# EAGLE design AVR-USB-Downloader (EAGLE 6.3)
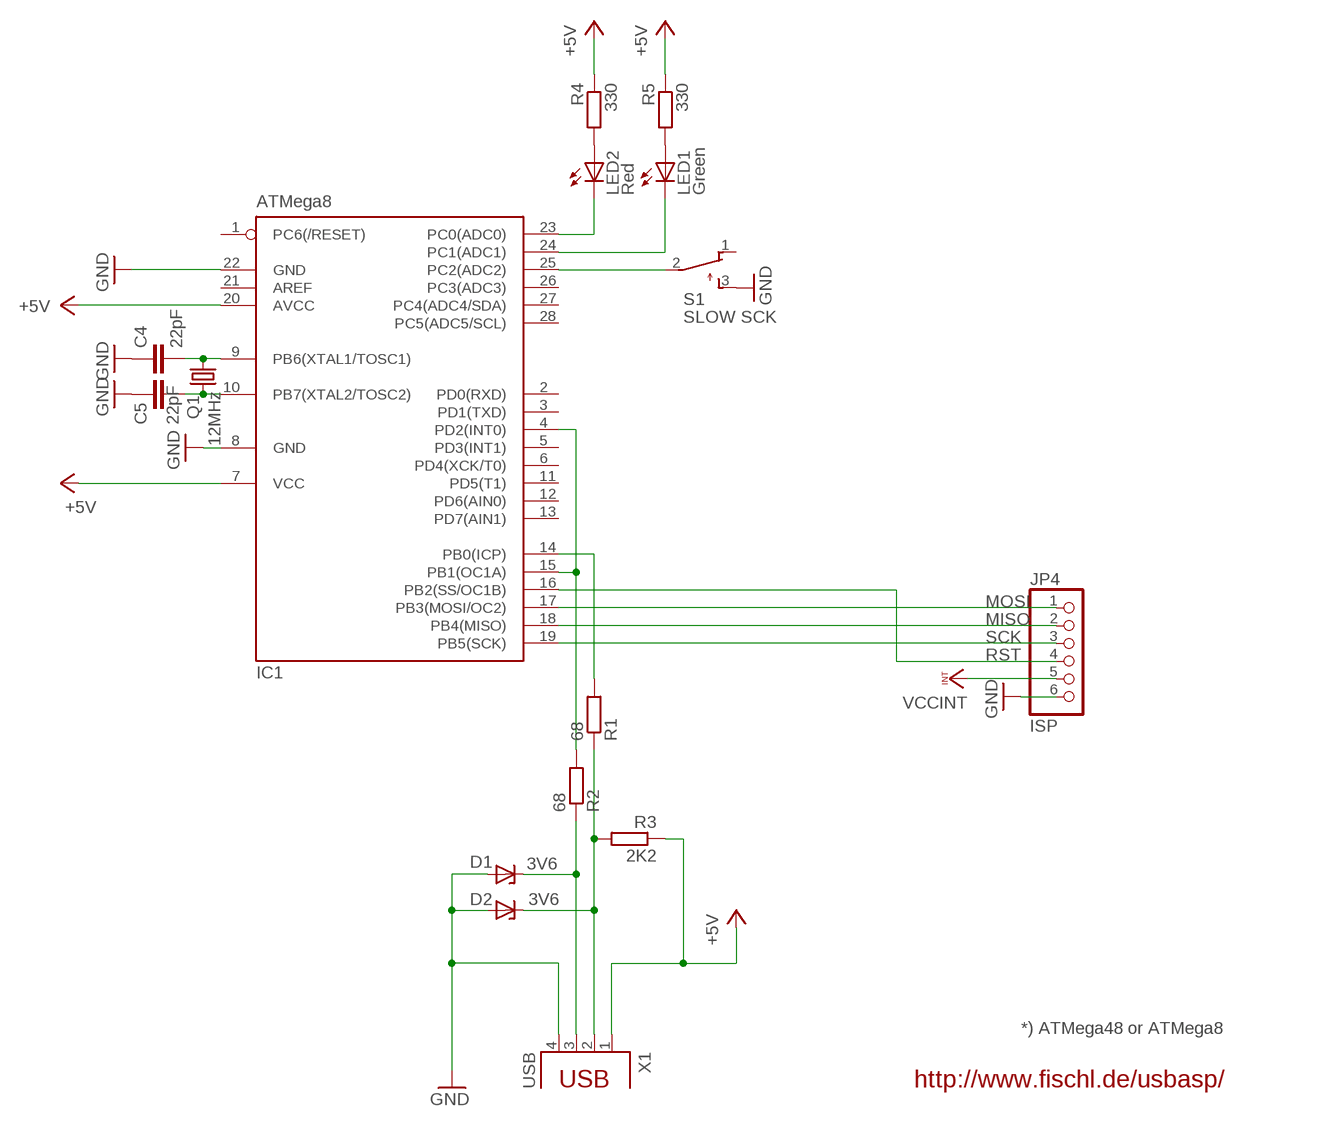
[diagram p0: schematic, sheet 1]

## Parts
C4  22pF  C-EU025-024X044  [C025-024X044]
C5  22pF  C-EU025-024X044  [C025-024X044]
D1  3V6  ZENER-DIODEDO34-7  [DO34Z7]
D2  3V6  ZENER-DIODEDO34-7  [DO34Z7]
IC1  ATMega8  MEGA8-P  [DIL28-3]
JP4  ISP  PINHD-1X6  [1X06]
LED1  Green  LED3MM  [LED3MM]
LED2  Red  LED3MM  [LED3MM]
Q1  12MHz  CRYTALHC49S  [HC49/S]
R1  68  R-EU_0207/10  [0207/10]
R2  68  R-EU_0207/10  [0207/10]
R3  2K2  R-EU_0207/10  [0207/10]
R4  330  R-EU_0207/10  [0207/10]
R5  330  R-EU_0207/10  [0207/10]
S1  SLOW SCK  TL32PO  [TL3XPO]
X1  USB  PN61729  [PN61729]

## Nets
+5V: IC1.7(VCC) IC1.20(AVCC) R3.1 R4.1 R5.1 X1.1
GND: C4.1 C5.1 D1.A D2.A IC1.8(GND) IC1.22(GND) JP4.6 S1.3(S) X1.4
MISO: IC1.18(PB4(MISO)) JP4.2
MOSI: IC1.17(PB3(MOSI/OC2)) JP4.1
N$5: D2.C R1.1 R3.2 X1.2
N$7: IC1.4(PD2(INT0)) IC1.15(PB1(OC1A)) R2.2
N$8: D1.C R2.1 X1.3
N$12: IC1.25(PC2(ADC2)) S1.2(P)
N$13: LED2.A R4.2
N$14: IC1.23(PC0(ADC0)) LED2.K(C)
N$15: IC1.24(PC1(ADC1)) LED1.K(C)
N$16: IC1.14(PB0(ICP)) R1.2
N$22: C4.2 IC1.9(PB6(XTAL1/TOSC1)) Q1.2
N$23: C5.2 IC1.10(PB7(XTAL2/TOSC2)) Q1.1
N$25: LED1.A R5.2
RST: IC1.16(PB2(SS/OC1B)) JP4.4
SCK: IC1.19(PB5(SCK)) JP4.3
VCCINT: JP4.5
Unconnected: IC1.1(PC6(/RESET)) IC1.2(PD0(RXD)) IC1.3(PD1(TXD)) IC1.5(PD3(INT1)) IC1.6(PD4(XCK/T0)) IC1.11(PD5(T1)) IC1.12(PD6(AIN0)) IC1.13(PD7(AIN1)) IC1.21(AREF) IC1.26(PC3(ADC3)) IC1.27(PC4(ADC4/SDA)) IC1.28(PC5(ADC5/SCL)) S1.1(O)

## Notes on the sheet
- *) ATMega48 or ATMega8
- http://www.fischl.de/usbasp/

## Library data of the parts
C4 C5 = rcl:C-EU: CAPACITOR, European symbol
D1 D2 = diode:ZENER-DIODE: Z-Diode
IC1 = atmel:MEGA8-P: MICROCONTROLLER 8 Kbytes FLASH, 1 kbytes SRAM, 512 bytes EEPROM, USART, 4-channel 10 bit ADC, 2-channel 8 bit ADC Pin compatible with Atmega48, ATMega88, ATMega168 Source: avr.lbr; OC_FARNELL: unknown; OC_NEWARK: unknown
JP4 = pinhead:PINHD-1X6: PIN HEADER
LED1 LED2 = led:LED: LED OSRAM: - CHIPLED LG R971, LG N971, LY N971, LG Q971, LY Q971, LO R971, LY R971 LH N974, LH R974 LS Q976, LO Q976, LY Q976 LO Q996 - Hyper CHIPLED LW Q18S LB Q993, LB Q99A, LB R99A - SideLED LS A670, LO A670, LY A670, LG A670, LP A670 LB A673, LV A673, LT A673, LW A673 LH A674 LY A675 LS A676, LA A676, LO A676, LY A676, LW A676 LS A679, LY A679, LG A679 - Hyper Micro SIDELED® LS Y876, LA Y876, LO Y876, LY Y876 LT Y87S - SmartLED LW L88C, LW L88S LB L89C, LB L89S, LG L890 LS L89K, LO L89K, LY L89K LS L896, LA L896, LO L896, LY L896 - TOPLED LS T670, LO T670, LY T670, LG T670, LP T670 LSG T670, LSP T670, LSY T670, LOP T670, LYG T670 LG T671, LOG T671, LSG T671 LB T673, LV T673, LT T673, LW T673 LH T674 LS T676, LA T676, LO T676, LY T676, LB T676, LH T676, LSB T676, LW T676 LB T67C, LV T67C, LT T67C, LS T67K, LO T67K, LY T67K, LW E67C LS E67B, LA E67B, LO E67B, LY E67B, LB E67C, LV E67C, LT E67C LW T67C LS T679, LY T679, LG T679 LS T770, LO T770, LY T770, LG T770, LP T770 LB T773, LV T773, LT T773, LW T773 LH T774 LS E675, LA E675, LY E675, LS T675 LS T776, LA T776, LO T776, LY T776, LB T776 LHGB T686 LT T68C, LB T68C - Hyper Mini TOPLED® LB M676 - Mini TOPLED Santana® LG M470 LS M47K, LO M47K, LY M47K Source: http://www.osram.convergy.de LUXEON: - LUMILED® LXK2-PW12-R00, LXK2-PW12-S00, LXK2-PW14-U00, LXK2-PW14-V00 LXK2-PM12-R00, LXK2-PM12-S00, LXK2-PM14-U00 LXK2-PE12-Q00, LXK2-PE12-R00, LXK2-PE12-S00, LXK2-PE14-T00, LXK2-PE14-U00 LXK2-PB12-K00, LXK2-PB12-L00, LXK2-PB12-M00, LXK2-PB14-N00, LXK2-PB14-P00, LXK2-PB14-Q00 LXK2-PR12-L00, LXK2-PR12-M00, LXK2-PR14-Q00, LXK2-PR14-R00 LXK2-PD12-Q00, LXK2-PD12-R00, LXK2-PD12-S00 LXK2-PH12-R00, LXK2-PH12-S00 LXK2-PL12-P00, LXK2-PL12-Q00, LXK2-PL12-R00 Source: www.luxeon.com KINGBRIGHT: KA-3528ASYC Source: www.kingbright.com
Q1 = crystal:CRYTAL: CRYSTAL
R1-R5 = rcl:R-EU_: RESISTOR, European symbol
S1 = switch:TL32PO: TINY SWITCH ON - MOM Source: http://www2.produktinfo.conrad.com/datenblaetter/700000-724999/705152-da-01-de-Subminiaturschalter_TL_36YO.pdf
X1 = con-berg:PN61729: BERG USB connector; OC_FARNELL: unknown; OC_NEWARK: unknown

## Board
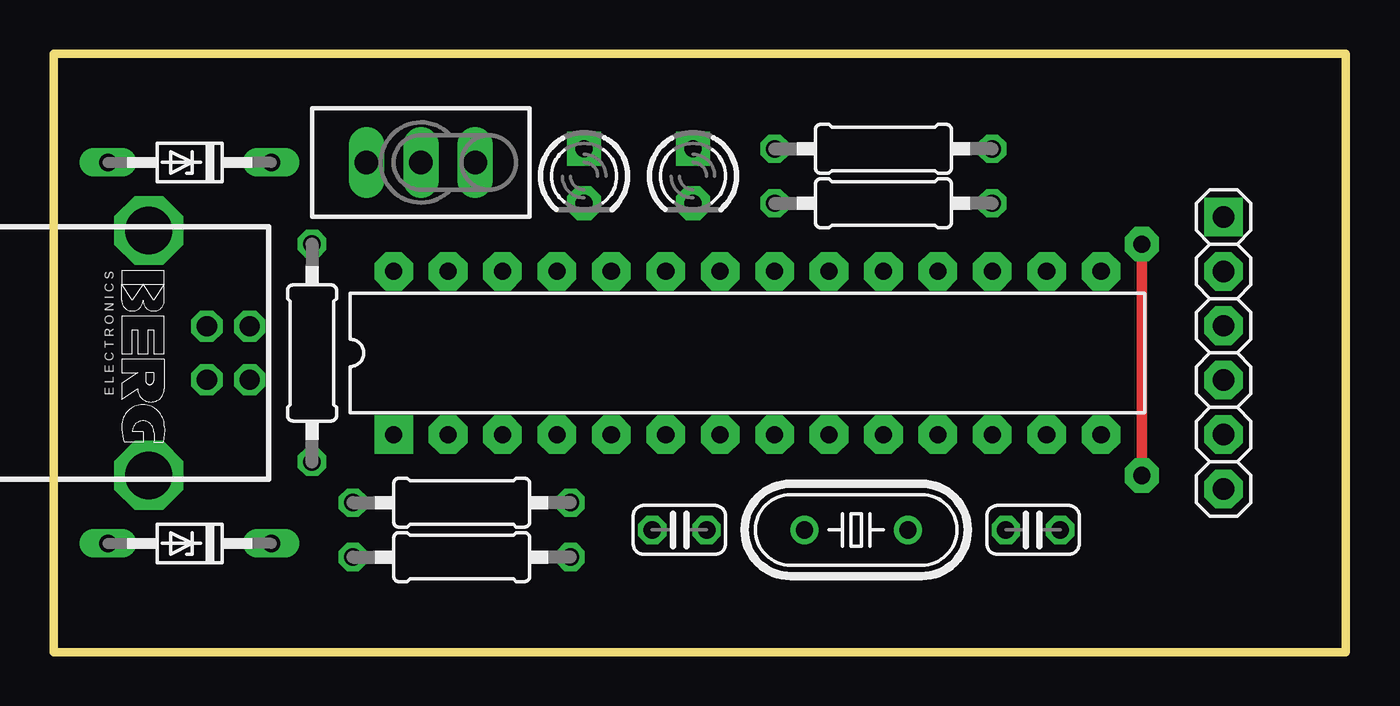
[diagram p1: board, top side]
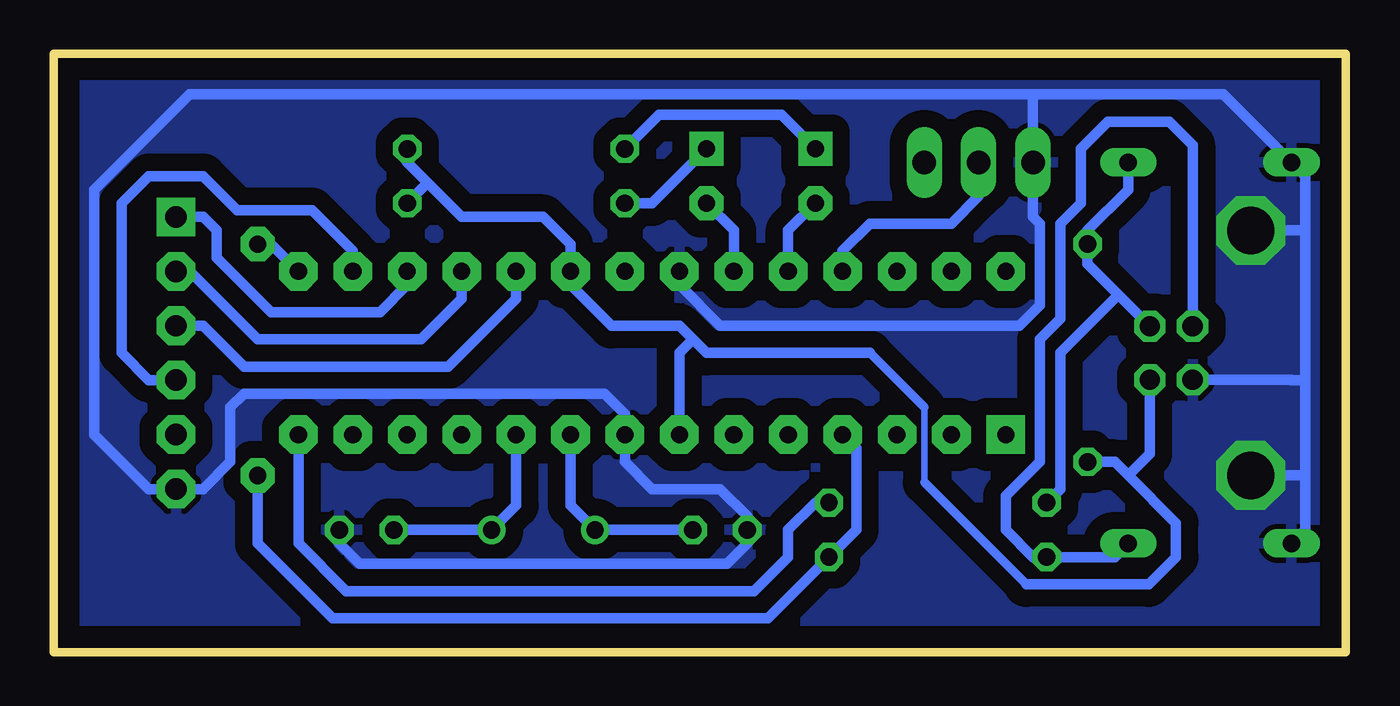
[diagram p2: board, bottom side, seen from below]

Size 60.33 x 27.94 mm. Coordinates in mm from the lower left corner, seen from the top.
Outline: 0,0 60.33,0 60.33,27.94 0,27.94 0,0
Copper layers (1*16): Top 0.035mm / dielectric 1.5mm / Bottom 0.035mm
Design rules "default *": minimum track width 0.3mm, minimum drill 0.8mm, track to track 8mil, track to pad 8mil, pad to pad 8mil, via to via 8mil, smd to smd 8mil, copper to edge 40mil, drill to drill 8mil, minimum pad ring 10mil, minimum via ring 8mil, stop-mask expansion 4mil, vias tented up to drill 0mil, thermal gap 10mil

### Footprints (pad centres in the part's own frame; a part is rotated, then mirrored left to right if it is on the bottom)
C025-024X044 = drill 0.813 octagon: 1 -1.27,0; 2 1.27,0
DO34Z7 = drill 0.813 long: A 3.81,0; C -3.81,0
DIL28-3 = drill 0.8 pad 1.8 square: 1 -16.51,-3.81 | drill 0.8 pad 1.8 octagon: 2 -13.97,-3.81; 3 -11.43,-3.81; 4 -8.89,-3.81; 5 -6.35,-3.81; 6 -3.81,-3.81; 7 -1.27,-3.81; 8 1.27,-3.81; 9 3.81,-3.81; 10 6.35,-3.81; 11 8.89,-3.81; 12 11.43,-3.81; 13 13.97,-3.81; 14 16.51,-3.81; 15 16.51,3.81; 16 13.97,3.81; 17 11.43,3.81; 18 8.89,3.81; 19 6.35,3.81; 20 3.81,3.81; 21 1.27,3.81; 22 -1.27,3.81; 23 -3.81,3.81; 24 -6.35,3.81; 25 -8.89,3.81; 26 -11.43,3.81; 27 -13.97,3.81; 28 -16.51,3.81
1X06 = drill 1 pad 1.8 square: 1 -6.35,0 | drill 1 pad 1.8 octagon: 2 -3.81,0; 3 -1.27,0; 4 1.27,0; 5 3.81,0; 6 6.35,0
LED3MM = drill 0.8 pad 1.6 square: A -1.27,0 | drill 0.8 pad 1.6 octagon: K 1.27,0
HC49/S = drill 0.813: 1 -2.413,0; 2 2.413,0
0207/10 = drill 0.813 octagon: 1 -5.08,0; 2 5.08,0
TL3XPO = drill 1.1 pad 1.422 long: 1 -2.54,0; 2 0,0; 3 2.54,0
PN61729 = drill 0.95 octagon: 1 1.25,4.71; 2 -1.25,4.71; 3 -1.25,2.71; 4 1.25,2.71

### Placement (x,y rotation side)
C4  29.21,5.71 0 top
C5  45.72,5.71 180 top
D1  6.35,5.08 180 top
D2  6.35,22.86 180 top
IC1  32.38,13.97 0 top
JP4  54.61,13.97 270 top
LED1  24.77,22.23 270 top
LED2  29.84,22.23 270 top
Q1  37.47,5.71 180 top
R1  19.05,6.98 0 top
R2  19.05,4.45 0 top
R3  12.07,13.97 90 top
R4  38.73,20.95 180 top
R5  38.73,23.49 180 top
S1  17.14,22.86 180 top
X1  4.45,13.97 270 top

### Tracks (layer width: path | path; a pad name or v marks a point on that pad's centre or on a via)
+5V
  Bottom 0.3: 19.69,7.94 19.69,11.43
  Bottom 0.4: 14.92,3.17 19.69,7.94 | 19.69,11.43 22.23,13.97
  Bottom 0.5: R5.1 43.81,22.86 42.86,21.91 | 42.86,21.91 41.28,20.32 37.47,20.32 36.2,19.05 IC1.20 36.2,17.14 34.29,15.24 31.12,15.24 30.48,14.6 | 42.86,21.91 R4.1 | R3.1 10.79,8.89 10.16,8.25 | 10.16,8.25 7.94,6.03 7.94,4.45 9.21,3.17 14.92,3.17 | X1.1 9.16,9.26 10.16,8.25 | 30.48,14.6 29.84,13.97 22.23,13.97 | IC1.7 31.12,13.97 30.48,14.6
GND  (via drill 2.2)
  Bottom 0.5: C5.1 46.99,5.08 46.04,4.13 28.89,4.13 27.94,5.08 C4.1 27.94,6.35 29.21,7.62 32.38,7.62 33.66,8.89 IC1.8 33.66,11.11 34.61,12.06 51.44,12.06 52.07,11.43 52.07,8.89 53.34,7.62 JP4.6 55.88,7.62 58.42,10.16 58.42,21.59 53.98,26.04 14.61,26.04 | X1.4 2.56,12.72 2.54,12.7 1.91,12.7 | 1.91,8.25 1.91,5.71 D1.A | 1.91,8.25 1.91,12.7 | 1.91,12.7 1.91,19.68 | 1.91,19.68 1.91,22.23 D2.A 5.71,26.04 14.61,26.04 | IC1.22 31.12,17.14 29.21,15.24 15.24,15.24 14.29,16.19 14.29,20 14.61,20.32 S1.3 14.61,26.04 | 1.91,19.68 v4.45,19.68 | 1.91,8.25 v4.45,8.25
  pour Bottom (isolate 0.8): 0,27.94 60.33,27.94 60.33,0 0,0
MISO
  Bottom 0.5: IC1.18 41.28,16.51 43.18,14.6 50.8,14.6 53.98,17.78 JP4.2
MOSI
  Bottom 0.5: IC1.17 43.81,17.14 45.09,15.88 50.16,15.88 52.7,18.41 52.7,19.68 53.34,20.32 JP4.1
N$1
  pour Bottom (isolate 0.8): 0,27.94 60.33,27.94 60.33,0 0,0
N$5
  Bottom 0.5: D2.C 10.16,21.59 12.07,19.68 R3.2 12.07,18.13 10.62,16.68 | 10.62,16.68 X1.2 | R1.1 13.34,7.62 13.34,13.97 10.62,16.68
N$7  (via drill 0.8 pad 1.6)
  Top 0.5: v50.8,8.25 v50.8,19.05
  Bottom 0.5: IC1.4 22.86,9.52 22.86,5.71 R2.2 26.99,1.59 47.31,1.59 50.8,5.08 v50.8,8.25 | IC1.15 50.16,19.05 v50.8,19.05
N$8
  Bottom 0.5: D1.C 10.79,4.45 R2.1 14.61,4.45 15.88,5.71 15.88,7.3 14.29,8.89 14.29,14.6 13.34,15.56 13.34,20 12.38,20.95 12.38,23.49 11.11,24.77 8.25,24.77 7.16,23.66 X1.3
N$12
  Bottom 0.5: S1.2 17.14,21.27 18.41,20 22.23,20 23.5,18.73 IC1.25
N$13
  Bottom 0.5: R4.2 32.38,20.95 LED2.A
N$14
  Bottom 0.5: LED2.K 28.57,19.68 IC1.23
N$15
  Bottom 0.5: LED1.K 26.04,19.68 IC1.24
N$16
  Bottom 0.5: R1.2 24.77,6.98 26.04,5.71 26.04,4.45 27.62,2.86 46.67,2.86 48.89,5.08 IC1.14
N$22
  Bottom 0.5: IC1.9 36.2,6.86 Q1.2 C4.2
N$23
  Bottom 0.5: IC1.10 38.73,6.86 Q1.1 C5.2
N$25
  Bottom 0.5: LED1.A 26.35,25.08 32.07,25.08 R5.2
RST
  Bottom 0.5: IC1.16 46.36,18.73 48.26,20.64 51.75,20.64 53.34,22.23 55.88,22.23 57.15,20.95 57.15,13.97 55.88,12.7 JP4.4
SCK
  Bottom 0.5: IC1.19 38.73,16.51 41.91,13.34 51.44,13.34 53.34,15.24 JP4.3

### Text on the board
tValues: MOSI | MISO | SCK | RST | VCC | GND